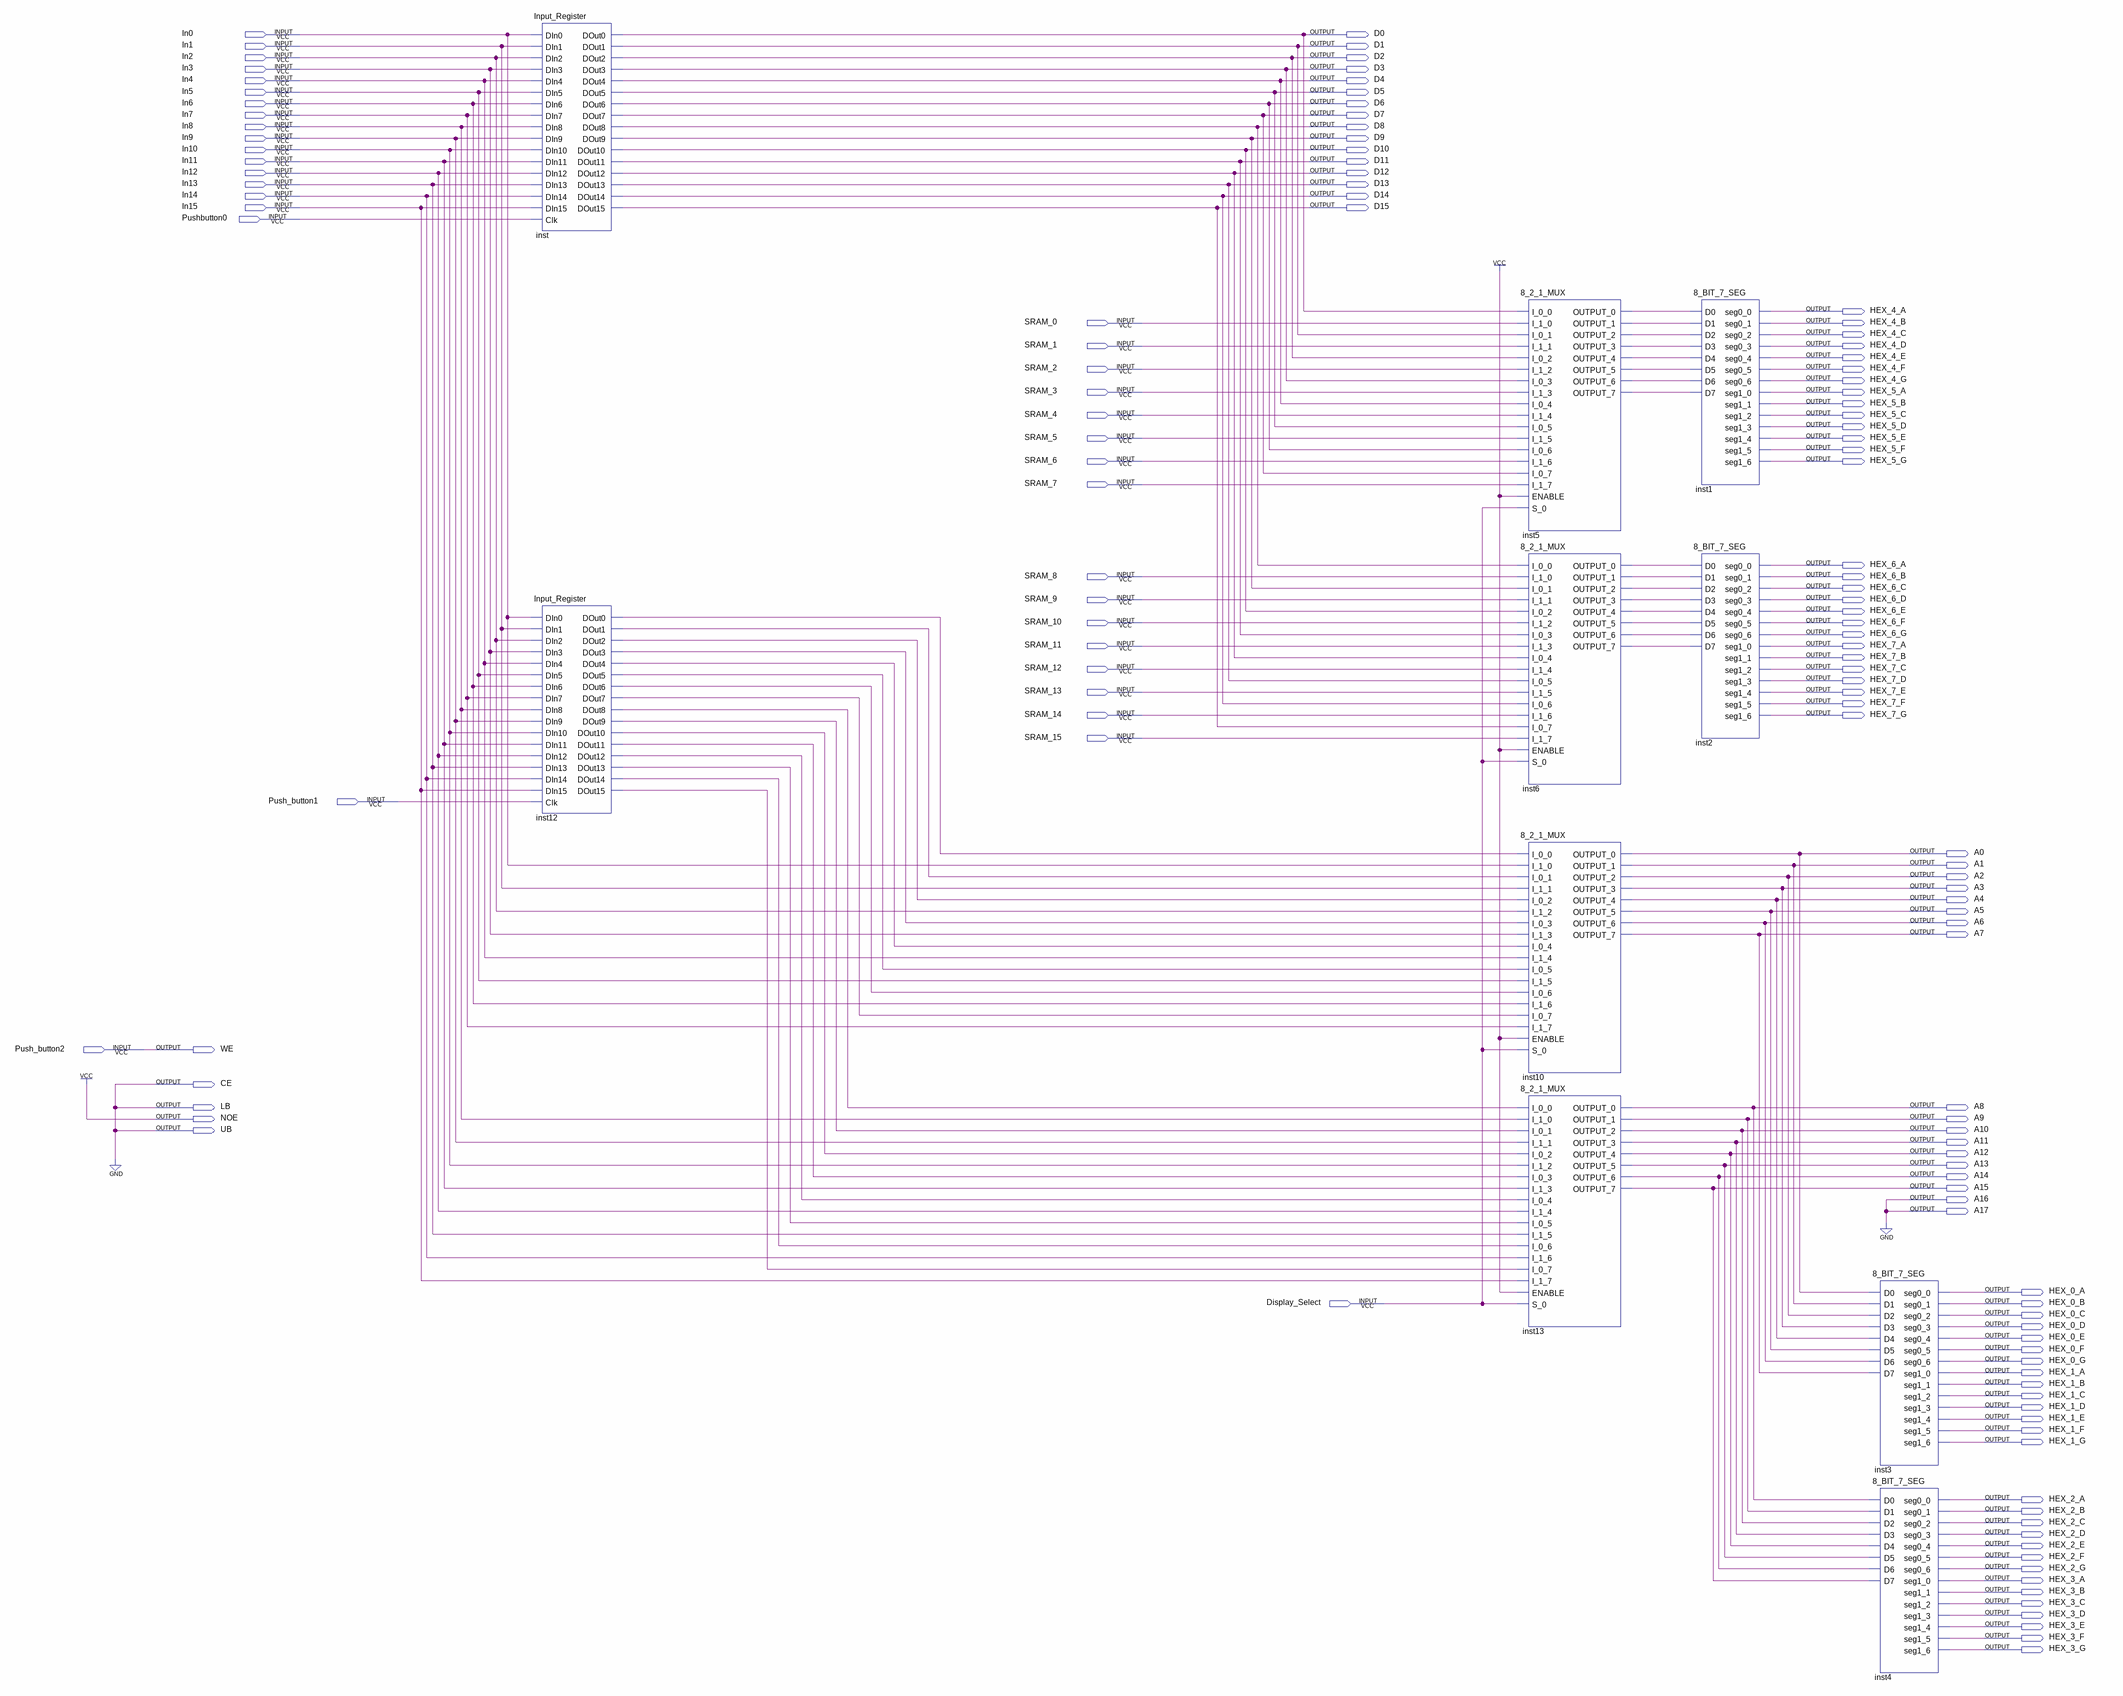
[diagram p0: schematic sheet]
// Quartus schematic Program.bdf as structural Verilog: 10 symbols, 131 pins
module Program (
  input  In0,
  input  In1,
  input  In2,
  input  In3,
  input  In4,
  input  In5,
  input  In6,
  input  In7,
  input  In8,
  input  In9,
  input  In10,
  input  In11,
  input  In12,
  input  In13,
  input  In14,
  input  In15,
  input  Pushbutton0,
  input  SRAM_0,
  input  SRAM_1,
  input  SRAM_2,
  input  SRAM_3,
  input  SRAM_4,
  input  SRAM_5,
  input  SRAM_6,
  input  SRAM_7,
  input  SRAM_8,
  input  SRAM_9,
  input  SRAM_10,
  input  SRAM_11,
  input  SRAM_12,
  input  SRAM_13,
  input  SRAM_14,
  input  SRAM_15,
  input  Push_button1,
  input  Push_button2,
  input  Display_Select,
  output D0,
  output D1,
  output D2,
  output D3,
  output D4,
  output D5,
  output D6,
  output D7,
  output D8,
  output D9,
  output D10,
  output D11,
  output D12,
  output D13,
  output D14,
  output D15,
  output HEX_4_A,
  output HEX_4_B,
  output HEX_4_C,
  output HEX_4_D,
  output HEX_4_E,
  output HEX_4_F,
  output HEX_4_G,
  output HEX_5_A,
  output HEX_5_B,
  output HEX_5_C,
  output HEX_5_D,
  output HEX_5_E,
  output HEX_5_F,
  output HEX_5_G,
  output HEX_6_A,
  output HEX_6_B,
  output HEX_6_C,
  output HEX_6_D,
  output HEX_6_E,
  output HEX_6_F,
  output HEX_6_G,
  output HEX_7_A,
  output HEX_7_B,
  output HEX_7_C,
  output HEX_7_D,
  output HEX_7_E,
  output HEX_7_F,
  output HEX_7_G,
  output A0,
  output A1,
  output A2,
  output A3,
  output A4,
  output A5,
  output A6,
  output A7,
  output WE,
  output CE,
  output LB,
  output A8,
  output NOE,
  output A9,
  output UB,
  output A10,
  output A11,
  output A12,
  output A13,
  output A14,
  output A15,
  output A16,
  output A17,
  output HEX_0_A,
  output HEX_0_B,
  output HEX_0_C,
  output HEX_0_D,
  output HEX_0_E,
  output HEX_0_F,
  output HEX_0_G,
  output HEX_1_A,
  output HEX_1_B,
  output HEX_1_C,
  output HEX_1_D,
  output HEX_1_E,
  output HEX_1_F,
  output HEX_1_G,
  output HEX_2_A,
  output HEX_2_B,
  output HEX_2_C,
  output HEX_2_D,
  output HEX_2_E,
  output HEX_2_F,
  output HEX_2_G,
  output HEX_3_A,
  output HEX_3_B,
  output HEX_3_C,
  output HEX_3_D,
  output HEX_3_E,
  output HEX_3_F,
  output HEX_3_G
);

  wire inst5_output_0, inst5_output_1, inst5_output_2, inst5_output_3, inst5_output_4, inst5_output_5,
       inst5_output_6, inst5_output_7, inst6_output_0, inst6_output_1, inst6_output_2, inst6_output_3,
       inst6_output_4, inst6_output_5, inst6_output_6, inst6_output_7, inst12_dout0, inst12_dout1,
       inst12_dout2, inst12_dout3, inst12_dout4, inst12_dout5, inst12_dout6, inst12_dout7, inst12_dout8,
       inst12_dout9, inst12_dout10, inst12_dout11, inst12_dout12, inst12_dout13, inst12_dout14, inst12_dout15;

  Input_Register inst (
    .DIn0(In0), .DIn1(In1), .DIn2(In2), .DIn3(In3), .DIn4(In4), .DIn5(In5), .DIn6(In6), .DIn7(In7),
    .DIn8(In8), .DIn9(In9), .DIn10(In10), .DIn11(In11), .DIn12(In12), .DIn13(In13), .DIn14(In14),
    .DIn15(In15), .Clk(Pushbutton0), .DOut0(D0), .DOut1(D1), .DOut2(D2), .DOut3(D3), .DOut4(D4), .DOut5(D5),
    .DOut6(D6), .DOut7(D7), .DOut8(D8), .DOut9(D9), .DOut10(D10), .DOut11(D11), .DOut12(D12), .DOut13(D13),
    .DOut14(D14), .DOut15(D15));
  Input_Register inst12 (
    .DIn0(In0), .DIn1(In1), .DIn2(In2), .DIn3(In3), .DIn4(In4), .DIn5(In5), .DIn6(In6), .DIn7(In7),
    .DIn8(In8), .DIn9(In9), .DIn10(In10), .DIn11(In11), .DIn12(In12), .DIn13(In13), .DIn14(In14),
    .DIn15(In15), .Clk(Push_button1), .DOut0(inst12_dout0), .DOut1(inst12_dout1), .DOut2(inst12_dout2),
    .DOut3(inst12_dout3), .DOut4(inst12_dout4), .DOut5(inst12_dout5), .DOut6(inst12_dout6),
    .DOut7(inst12_dout7), .DOut8(inst12_dout8), .DOut9(inst12_dout9), .DOut10(inst12_dout10),
    .DOut11(inst12_dout11), .DOut12(inst12_dout12), .DOut13(inst12_dout13), .DOut14(inst12_dout14),
    .DOut15(inst12_dout15));
  \8_2_1_MUX  inst5 (
    .I_0_0(D0), .I_1_0(SRAM_0), .I_0_1(D1), .I_1_1(SRAM_1), .I_0_2(D2), .I_1_2(SRAM_2), .I_0_3(D3),
    .I_1_3(SRAM_3), .I_0_4(D4), .I_1_4(SRAM_4), .I_0_5(D5), .I_1_5(SRAM_5), .I_0_6(D6), .I_1_6(SRAM_6),
    .I_0_7(D7), .I_1_7(SRAM_7), .ENABLE(1'b1), .S_0(Display_Select), .OUTPUT_0(inst5_output_0),
    .OUTPUT_1(inst5_output_1), .OUTPUT_2(inst5_output_2), .OUTPUT_3(inst5_output_3),
    .OUTPUT_4(inst5_output_4), .OUTPUT_5(inst5_output_5), .OUTPUT_6(inst5_output_6), .OUTPUT_7(inst5_output_7));
  \8_2_1_MUX  inst6 (
    .I_0_0(D8), .I_1_0(SRAM_8), .I_0_1(D9), .I_1_1(SRAM_9), .I_0_2(D10), .I_1_2(SRAM_10), .I_0_3(D11),
    .I_1_3(SRAM_11), .I_0_4(D12), .I_1_4(SRAM_12), .I_0_5(D13), .I_1_5(SRAM_13), .I_0_6(D14),
    .I_1_6(SRAM_14), .I_0_7(D15), .I_1_7(SRAM_15), .ENABLE(1'b1), .S_0(Display_Select),
    .OUTPUT_0(inst6_output_0), .OUTPUT_1(inst6_output_1), .OUTPUT_2(inst6_output_2),
    .OUTPUT_3(inst6_output_3), .OUTPUT_4(inst6_output_4), .OUTPUT_5(inst6_output_5),
    .OUTPUT_6(inst6_output_6), .OUTPUT_7(inst6_output_7));
  \8_2_1_MUX  inst10 (
    .I_0_0(inst12_dout0), .I_1_0(In0), .I_0_1(inst12_dout1), .I_1_1(In1), .I_0_2(inst12_dout2), .I_1_2(In2),
    .I_0_3(inst12_dout3), .I_1_3(In3), .I_0_4(inst12_dout4), .I_1_4(In4), .I_0_5(inst12_dout5), .I_1_5(In5),
    .I_0_6(inst12_dout6), .I_1_6(In6), .I_0_7(inst12_dout7), .I_1_7(In7), .ENABLE(1'b1),
    .S_0(Display_Select), .OUTPUT_0(A0), .OUTPUT_1(A1), .OUTPUT_2(A2), .OUTPUT_3(A3), .OUTPUT_4(A4),
    .OUTPUT_5(A5), .OUTPUT_6(A6), .OUTPUT_7(A7));
  \8_2_1_MUX  inst13 (
    .I_0_0(inst12_dout8), .I_1_0(In8), .I_0_1(inst12_dout9), .I_1_1(In9), .I_0_2(inst12_dout10),
    .I_1_2(In10), .I_0_3(inst12_dout11), .I_1_3(In11), .I_0_4(inst12_dout12), .I_1_4(In12),
    .I_0_5(inst12_dout13), .I_1_5(In13), .I_0_6(inst12_dout14), .I_1_6(In14), .I_0_7(inst12_dout15),
    .I_1_7(In15), .ENABLE(1'b1), .S_0(Display_Select), .OUTPUT_0(A8), .OUTPUT_1(A9), .OUTPUT_2(A10),
    .OUTPUT_3(A11), .OUTPUT_4(A12), .OUTPUT_5(A13), .OUTPUT_6(A14), .OUTPUT_7(A15));
  \8_BIT_7_SEG  inst1 (
    .D0(inst5_output_0), .D1(inst5_output_1), .D2(inst5_output_2), .D3(inst5_output_3), .D4(inst5_output_4),
    .D5(inst5_output_5), .D6(inst5_output_6), .D7(inst5_output_7), .seg0_0(HEX_4_A), .seg0_1(HEX_4_B),
    .seg0_2(HEX_4_C), .seg0_3(HEX_4_D), .seg0_4(HEX_4_E), .seg0_5(HEX_4_F), .seg0_6(HEX_4_G),
    .seg1_0(HEX_5_A), .seg1_1(HEX_5_B), .seg1_2(HEX_5_C), .seg1_3(HEX_5_D), .seg1_4(HEX_5_E),
    .seg1_5(HEX_5_F), .seg1_6(HEX_5_G));
  \8_BIT_7_SEG  inst2 (
    .D0(inst6_output_0), .D1(inst6_output_1), .D2(inst6_output_2), .D3(inst6_output_3), .D4(inst6_output_4),
    .D5(inst6_output_5), .D6(inst6_output_6), .D7(inst6_output_7), .seg0_0(HEX_6_A), .seg0_1(HEX_6_B),
    .seg0_2(HEX_6_C), .seg0_3(HEX_6_D), .seg0_4(HEX_6_E), .seg0_5(HEX_6_F), .seg0_6(HEX_6_G),
    .seg1_0(HEX_7_A), .seg1_1(HEX_7_B), .seg1_2(HEX_7_C), .seg1_3(HEX_7_D), .seg1_4(HEX_7_E),
    .seg1_5(HEX_7_F), .seg1_6(HEX_7_G));
  \8_BIT_7_SEG  inst3 (
    .D0(A0), .D1(A1), .D2(A2), .D3(A3), .D4(A4), .D5(A5), .D6(A6), .D7(A7), .seg0_0(HEX_0_A),
    .seg0_1(HEX_0_B), .seg0_2(HEX_0_C), .seg0_3(HEX_0_D), .seg0_4(HEX_0_E), .seg0_5(HEX_0_F),
    .seg0_6(HEX_0_G), .seg1_0(HEX_1_A), .seg1_1(HEX_1_B), .seg1_2(HEX_1_C), .seg1_3(HEX_1_D),
    .seg1_4(HEX_1_E), .seg1_5(HEX_1_F), .seg1_6(HEX_1_G));
  \8_BIT_7_SEG  inst4 (
    .D0(A8), .D1(A9), .D2(A10), .D3(A11), .D4(A12), .D5(A13), .D6(A14), .D7(A15), .seg0_0(HEX_2_A),
    .seg0_1(HEX_2_B), .seg0_2(HEX_2_C), .seg0_3(HEX_2_D), .seg0_4(HEX_2_E), .seg0_5(HEX_2_F),
    .seg0_6(HEX_2_G), .seg1_0(HEX_3_A), .seg1_1(HEX_3_B), .seg1_2(HEX_3_C), .seg1_3(HEX_3_D),
    .seg1_4(HEX_3_E), .seg1_5(HEX_3_F), .seg1_6(HEX_3_G));

  assign A16 = 1'b0;
  assign A17 = 1'b0;
  assign CE = 1'b0;
  assign LB = 1'b0;
  assign NOE = 1'b1;
  assign UB = 1'b0;
  assign WE = Push_button2;
endmodule
